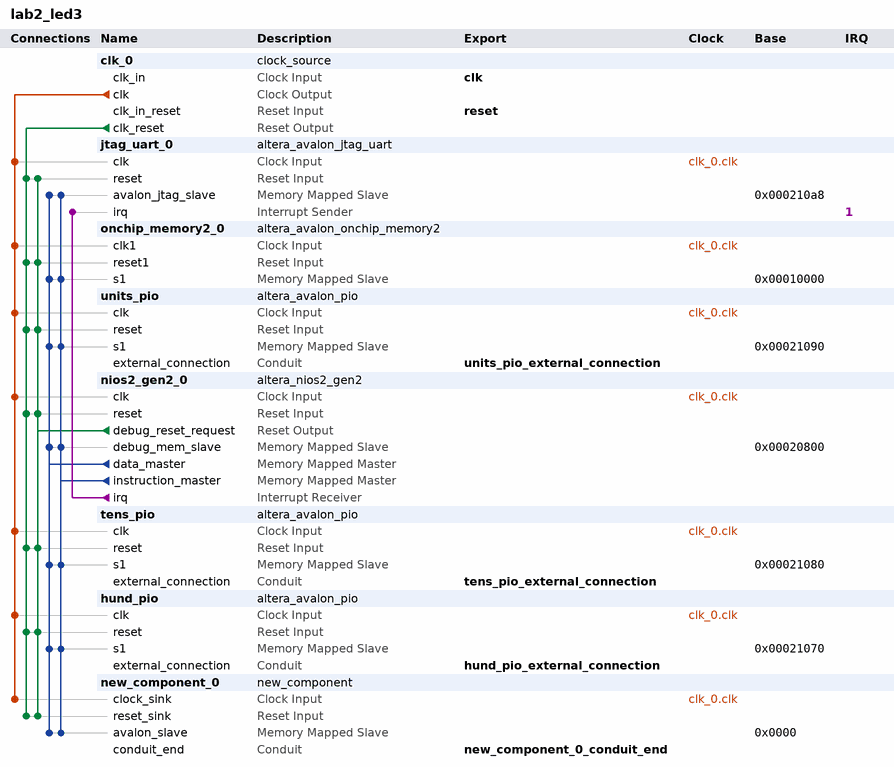
[diagram p0: system contents]
# Platform Designer (Qsys) system lab2_led3, MAX 10 10M50DAF484C7G
# Parameters at their usual value, and those the tool derives, are not listed.
package require -exact qsys 18.1
create_system lab2_led3
set_project_property DEVICE_FAMILY {MAX 10}
set_project_property DEVICE 10M50DAF484C7G

add_instance clk_0 clock_source 18.1
set_instance_parameter_value clk_0 clockFrequency 50000000

add_instance jtag_uart_0 altera_avalon_jtag_uart 18.1
set_instance_parameter_value jtag_uart_0 simInteractiveOptions NO_INTERACTIVE_WINDOWS

add_instance onchip_memory2_0 altera_avalon_onchip_memory2 18.1
set_instance_parameter_value onchip_memory2_0 dataWidth 32
set_instance_parameter_value onchip_memory2_0 dualPort false
set_instance_parameter_value onchip_memory2_0 initMemContent false
set_instance_parameter_value onchip_memory2_0 initializationFileName onchip_mem.hex
set_instance_parameter_value onchip_memory2_0 memorySize 40096

add_instance units_pio altera_avalon_pio 18.1
set_instance_parameter_value units_pio direction Output
set_instance_parameter_value units_pio width 4

add_instance nios2_gen2_0 altera_nios2_gen2 18.1
set_instance_parameter_value nios2_gen2_0 dcache_size 2048
set_instance_parameter_value nios2_gen2_0 exceptionSlave onchip_memory2_0.s1
set_instance_parameter_value nios2_gen2_0 icache_size 4096
set_instance_parameter_value nios2_gen2_0 impl Tiny
set_instance_parameter_value nios2_gen2_0 resetSlave onchip_memory2_0.s1

add_instance tens_pio altera_avalon_pio 18.1
set_instance_parameter_value tens_pio direction Output
set_instance_parameter_value tens_pio width 4

add_instance hund_pio altera_avalon_pio 18.1
set_instance_parameter_value hund_pio direction Output
set_instance_parameter_value hund_pio width 4

add_instance new_component_0 new_component 1.0

# connections
add_connection clk_0.clk hund_pio.clk clock
add_connection clk_0.clk jtag_uart_0.clk clock
add_connection clk_0.clk new_component_0.clock_sink clock
add_connection clk_0.clk nios2_gen2_0.clk clock
add_connection clk_0.clk onchip_memory2_0.clk1 clock
add_connection clk_0.clk tens_pio.clk clock
add_connection clk_0.clk units_pio.clk clock
add_connection clk_0.clk_reset hund_pio.reset reset
add_connection clk_0.clk_reset jtag_uart_0.reset reset
add_connection clk_0.clk_reset new_component_0.reset_sink reset
add_connection clk_0.clk_reset nios2_gen2_0.reset reset
add_connection clk_0.clk_reset onchip_memory2_0.reset1 reset
add_connection clk_0.clk_reset tens_pio.reset reset
add_connection clk_0.clk_reset units_pio.reset reset
add_connection nios2_gen2_0.debug_reset_request hund_pio.reset reset
add_connection nios2_gen2_0.debug_reset_request jtag_uart_0.reset reset
add_connection nios2_gen2_0.debug_reset_request new_component_0.reset_sink reset
add_connection nios2_gen2_0.debug_reset_request nios2_gen2_0.reset reset
add_connection nios2_gen2_0.debug_reset_request onchip_memory2_0.reset1 reset
add_connection nios2_gen2_0.debug_reset_request tens_pio.reset reset
add_connection nios2_gen2_0.debug_reset_request units_pio.reset reset
add_connection nios2_gen2_0.data_master hund_pio.s1 avalon
set_connection_parameter_value nios2_gen2_0.data_master/hund_pio.s1 baseAddress 0x00021070
add_connection nios2_gen2_0.data_master jtag_uart_0.avalon_jtag_slave avalon
set_connection_parameter_value nios2_gen2_0.data_master/jtag_uart_0.avalon_jtag_slave baseAddress 0x000210a8
add_connection nios2_gen2_0.data_master new_component_0.avalon_slave avalon
set_connection_parameter_value nios2_gen2_0.data_master/new_component_0.avalon_slave baseAddress 0x0000
add_connection nios2_gen2_0.data_master nios2_gen2_0.debug_mem_slave avalon
set_connection_parameter_value nios2_gen2_0.data_master/nios2_gen2_0.debug_mem_slave baseAddress 0x00020800
add_connection nios2_gen2_0.data_master onchip_memory2_0.s1 avalon
set_connection_parameter_value nios2_gen2_0.data_master/onchip_memory2_0.s1 baseAddress 0x00010000
add_connection nios2_gen2_0.data_master tens_pio.s1 avalon
set_connection_parameter_value nios2_gen2_0.data_master/tens_pio.s1 baseAddress 0x00021080
add_connection nios2_gen2_0.data_master units_pio.s1 avalon
set_connection_parameter_value nios2_gen2_0.data_master/units_pio.s1 baseAddress 0x00021090
add_connection nios2_gen2_0.instruction_master hund_pio.s1 avalon
set_connection_parameter_value nios2_gen2_0.instruction_master/hund_pio.s1 baseAddress 0x00021070
add_connection nios2_gen2_0.instruction_master jtag_uart_0.avalon_jtag_slave avalon
set_connection_parameter_value nios2_gen2_0.instruction_master/jtag_uart_0.avalon_jtag_slave baseAddress 0x000210a8
add_connection nios2_gen2_0.instruction_master new_component_0.avalon_slave avalon
set_connection_parameter_value nios2_gen2_0.instruction_master/new_component_0.avalon_slave baseAddress 0x0000
add_connection nios2_gen2_0.instruction_master nios2_gen2_0.debug_mem_slave avalon
set_connection_parameter_value nios2_gen2_0.instruction_master/nios2_gen2_0.debug_mem_slave baseAddress 0x00020800
add_connection nios2_gen2_0.instruction_master onchip_memory2_0.s1 avalon
set_connection_parameter_value nios2_gen2_0.instruction_master/onchip_memory2_0.s1 baseAddress 0x00010000
add_connection nios2_gen2_0.instruction_master tens_pio.s1 avalon
set_connection_parameter_value nios2_gen2_0.instruction_master/tens_pio.s1 baseAddress 0x00021080
add_connection nios2_gen2_0.instruction_master units_pio.s1 avalon
set_connection_parameter_value nios2_gen2_0.instruction_master/units_pio.s1 baseAddress 0x00021090
add_connection nios2_gen2_0.irq jtag_uart_0.irq interrupt
set_connection_parameter_value nios2_gen2_0.irq/jtag_uart_0.irq irqNumber 1

# exported interfaces
add_interface clk clock sink
set_interface_property clk EXPORT_OF clk_0.clk_in
add_interface hund_pio_external_connection conduit end
set_interface_property hund_pio_external_connection EXPORT_OF hund_pio.external_connection
add_interface new_component_0_conduit_end conduit end
set_interface_property new_component_0_conduit_end EXPORT_OF new_component_0.conduit_end
add_interface reset reset sink
set_interface_property reset EXPORT_OF clk_0.clk_in_reset
add_interface tens_pio_external_connection conduit end
set_interface_property tens_pio_external_connection EXPORT_OF tens_pio.external_connection
add_interface units_pio_external_connection conduit end
set_interface_property units_pio_external_connection EXPORT_OF units_pio.external_connection

set_interconnect_requirement {$system} qsys_mm.clockCrossingAdapter HANDSHAKE
set_interconnect_requirement {$system} qsys_mm.enableEccProtection FALSE
set_interconnect_requirement {$system} qsys_mm.insertDefaultSlave FALSE
set_interconnect_requirement {$system} qsys_mm.maxAdditionalLatency 1

save_system lab2_led3.qsys
